# EAGLE schematic EBN Retrofit (EAGLE 9.6.2)
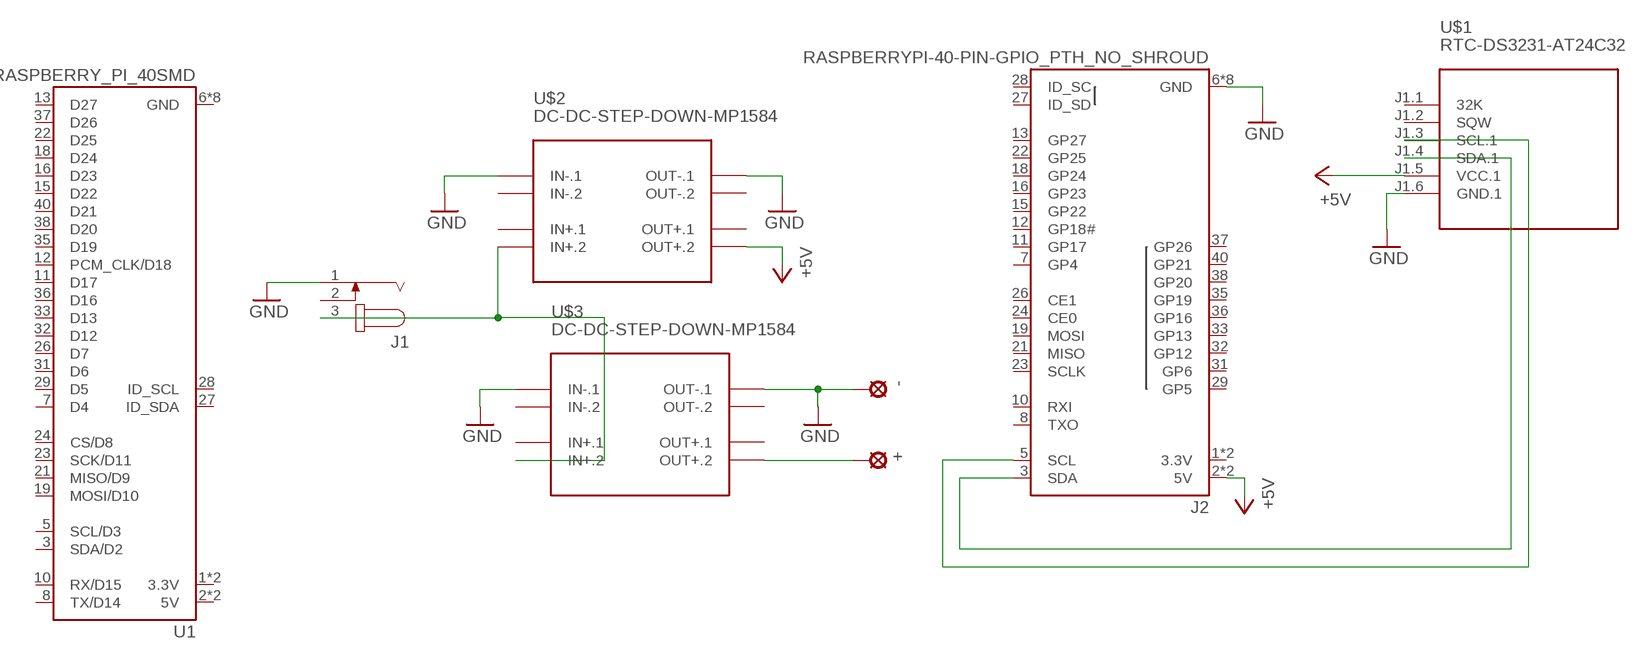
[diagram p0: schematic, sheet 1]

## Parts
+  SE11  [SE11]
-  SE11  [SE11]
J1  JACK-PLUG1  [SPC4078]
J2  RASPBERRYPI-40-PIN-GPIO_PTH_NO_SHROUD  [2X20]
U1  RASPBERRY_PI_40SMD  [RASPBERRY_PI_SHIELD_HOLES]
U$1  RTC-DS3231-AT24C32  [RTC-DS3231-AT24C32]
U$2  DC-DC-STEP-DOWN-MP1584  [DC-DC-STEP-DOWN-MP1584]
U$3  DC-DC-STEP-DOWN-MP1584  [DC-DC-STEP-DOWN-MP1584]

## Nets
+5V: J2.2(5V) J2.4(5V) U$1.J1.5(VCC.1) U$2.OUT+.2
GND: -.MP J1.1 J2.6(GND) J2.9(GND) J2.14(GND) J2.20(GND) J2.25(GND) J2.30(GND) J2.34(GND) J2.39(GND) U$1.J1.6(GND.1) U$2.IN-.1 U$2.OUT-.1 U$3.IN-.1 U$3.OUT-.1
N$3: +.MP U$3.OUT+.2
N$6: J2.3(SDA) U$1.J1.4(SDA.1)
N$7: J1.3 U$2.IN+.2 U$3.IN+.2
N$8: J2.5(SCL) U$1.J1.3(SCL.1)
Unconnected: J1.2 J2.7(GP4) J2.8(TXO) J2.10(RXI) J2.11(GP17) J2.12(GP18#) J2.13(GP27) J2.15(GP22) J2.16(GP23) J2.18(GP24) J2.19(MOSI) J2.21(MISO) J2.22(GP25) J2.23(SCLK) J2.24(CE0) J2.26(CE1) J2.27(ID_SD) J2.28(ID_SC) J2.29(GP5) J2.31(GP6) J2.32(GP12) J2.33(GP13) J2.35(GP19) J2.36(GP16) J2.37(GP26) J2.38(GP20) J2.40(GP21) U1.1(3.3V) U1.2(5V) U1.3(SDA/D2) U1.4(5V) U1.5(SCL/D3) U1.6(GND) U1.7(D4) U1.8(TX/D14) U1.9(GND) U1.10(RX/D15) U1.11(D17) U1.12(PCM_CLK/D18) U1.13(D27) U1.14(GND) U1.15(D22) U1.16(D23) U1.17(3.3V) U1.18(D24) U1.19(MOSI/D10) U1.20(GND) U1.21(MISO/D9) U1.22(D25) U1.23(SCK/D11) U1.24(CS/D8) U1.25(GND) U1.26(D7) U1.27(ID_SDA) U1.28(ID_SCL) U1.29(D5) U1.30(GND) U1.31(D6) U1.32(D12) U1.33(D13) U1.34(GND) U1.35(D19) U1.36(D16) U1.37(D26) U1.38(D20) U1.39(GND) U1.40(D21) U$1.J1.1(32K) U$1.J1.2(SQW) U$2.IN+.1 U$2.IN-.2 U$2.OUT+.1 U$2.OUT-.2 U$3.IN+.1 U$3.IN-.2 U$3.OUT+.1 U$3.OUT-.2

## Power pins joined to a net without a drawn wire
3.3V: J2.1(3.3V) J2.17(3.3V)

## Library data of the parts
+ - = solpad:SE11: SOLDER PAD RTM, drill 1,1mm, distributor Buerklin, 07F810
J1 = con-jack:JACK-PLUG: DC POWER JACK Power Jack, DC, Right Angle, Through Hole, Rated 5A at 16VDC, PC Terminals Distributor: Farnell (www.Farnell.de) Drawing: 84N1161.pdf / 84N1162.pdf Manufacturer: SPC Technology (www.spctechnology.com) Type: SPC4077 / SPC 4078; OC_FARNELL: unknown; OC_NEWARK: unknown
J2 = GHIISparkFun-Connectors:RASPBERRYPI-40-PIN-GPIO: Raspberry Pi GPIO Header 2x20 pin connector, as found on B, B+, A+ models. Both shrouded PTH and SMT versions available. SparkFun Products: GPIO Shrouded Header <https://www.sparkfun.com/products/13054>- PTH SparkFun Pi Wedge (Preassembled) <https://www.sparkfun.com/products/13717>
U1 = GHIISparkFun-Connectors:RASPBERRY_PI_40
U$1 = GHIdiy-modulesRTC:RTC-DS3231-AT24C32: RTC Module with Battery and EEPROM based on DS3231 and AT24C32 chips Tutorial can be found here: https://edwardmallon.wordpress.com/2014/05/21/using-a-cheap-3-ds3231-rtc-at24c32-eeprom-from-ebay/ Click here to find device on ebay.com <http://www.ebay.com/sch/DS3231+AT24C32+module>
U$2 U$3 = GHIdiy-modules:DC-DC-STEP-DOWN-MP1584: DC/DC Step-Down Regulator based on MP1584 chip MP1584 datasheet available here: http://www.haoyuelectronics.com/Attachment/MP1584/MP1584.pdf Click here to find device on ebay.com <http://www.ebay.com/sch/mp1584+module>

## Net classes
0 default: width 0.889 mm, drill 0.889 mm, clearance 0.635 mm